# Altium schematic sheet fullCURRENT power motor drive.SchDoc: fullCURRENT 1.0
size C; Author: JNutzmann; CompanyName: FSE; DocumentNumber: 4
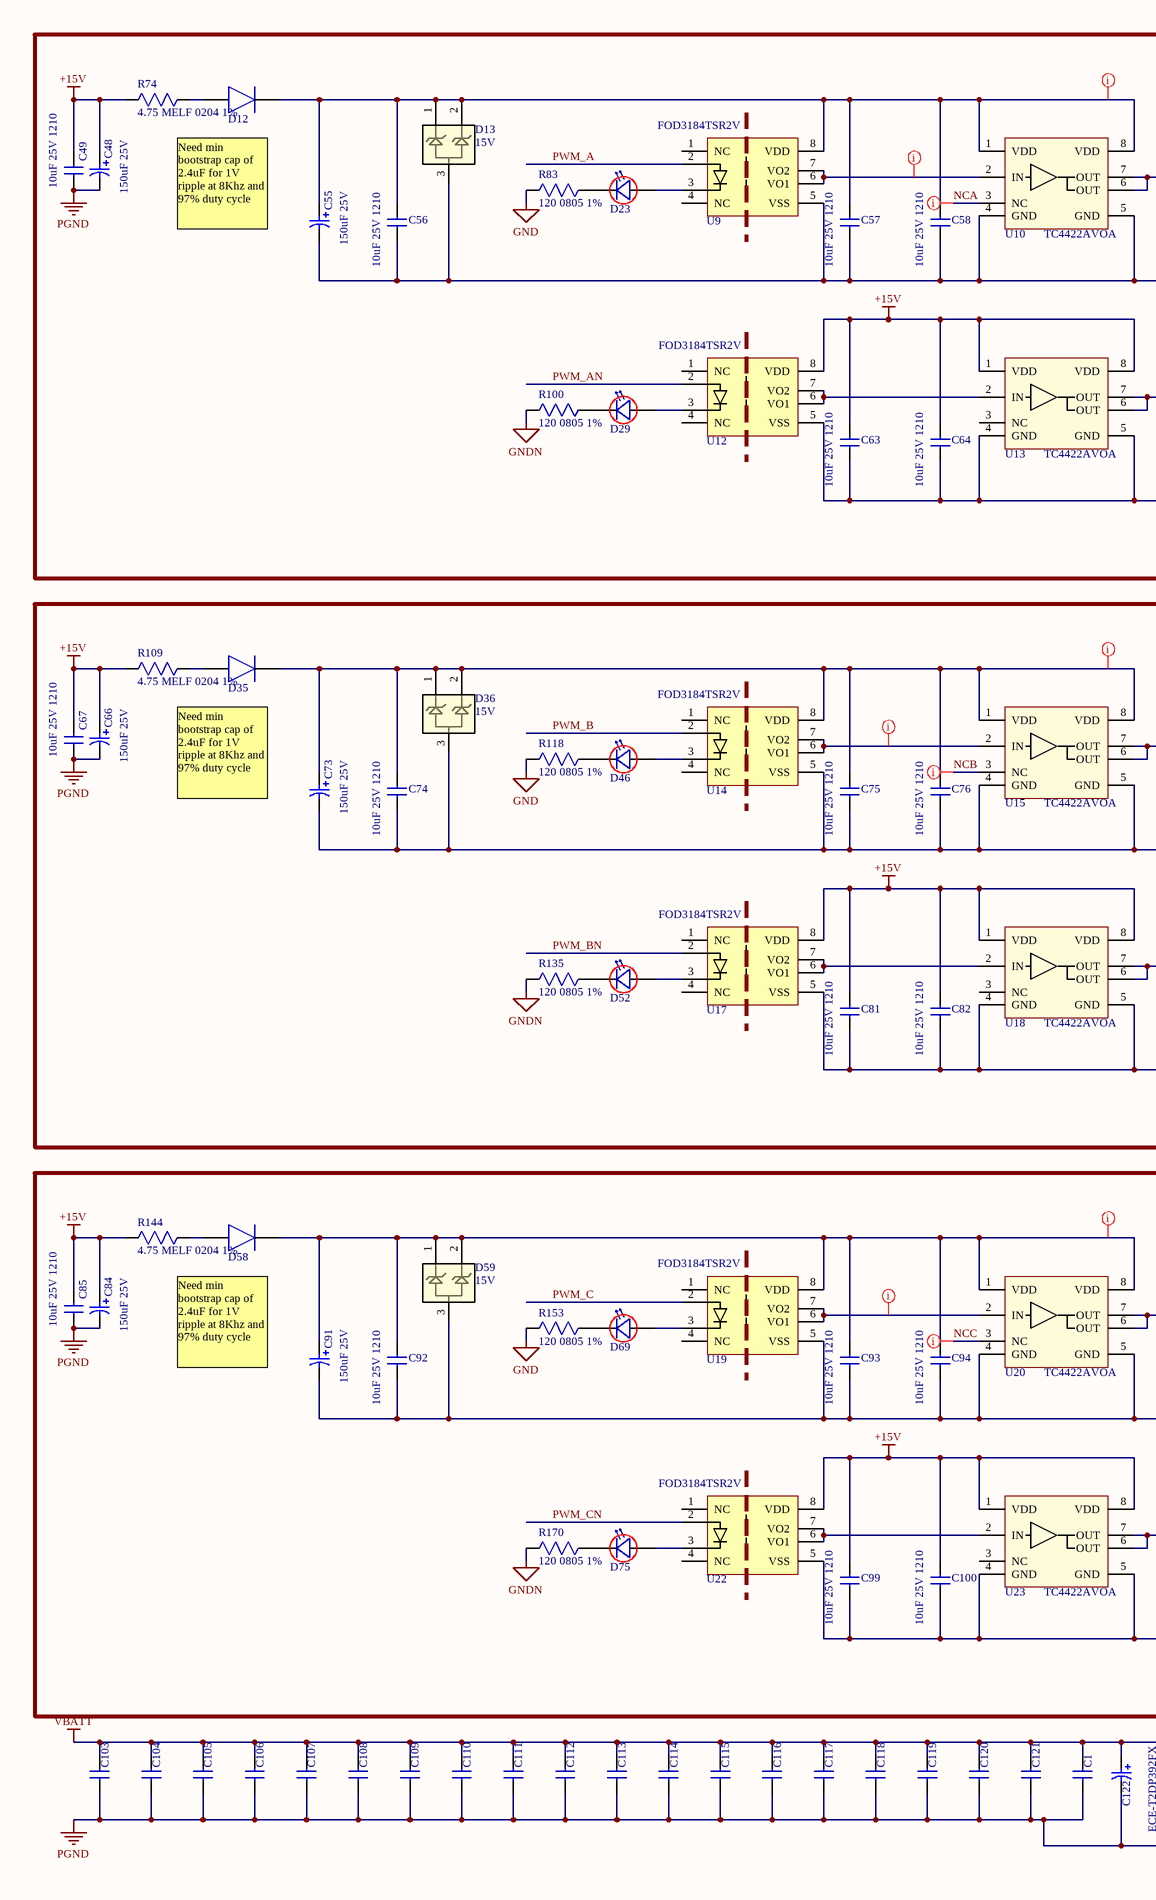
[diagram p0: fullCURRENT power motor drive.SchDoc, left]
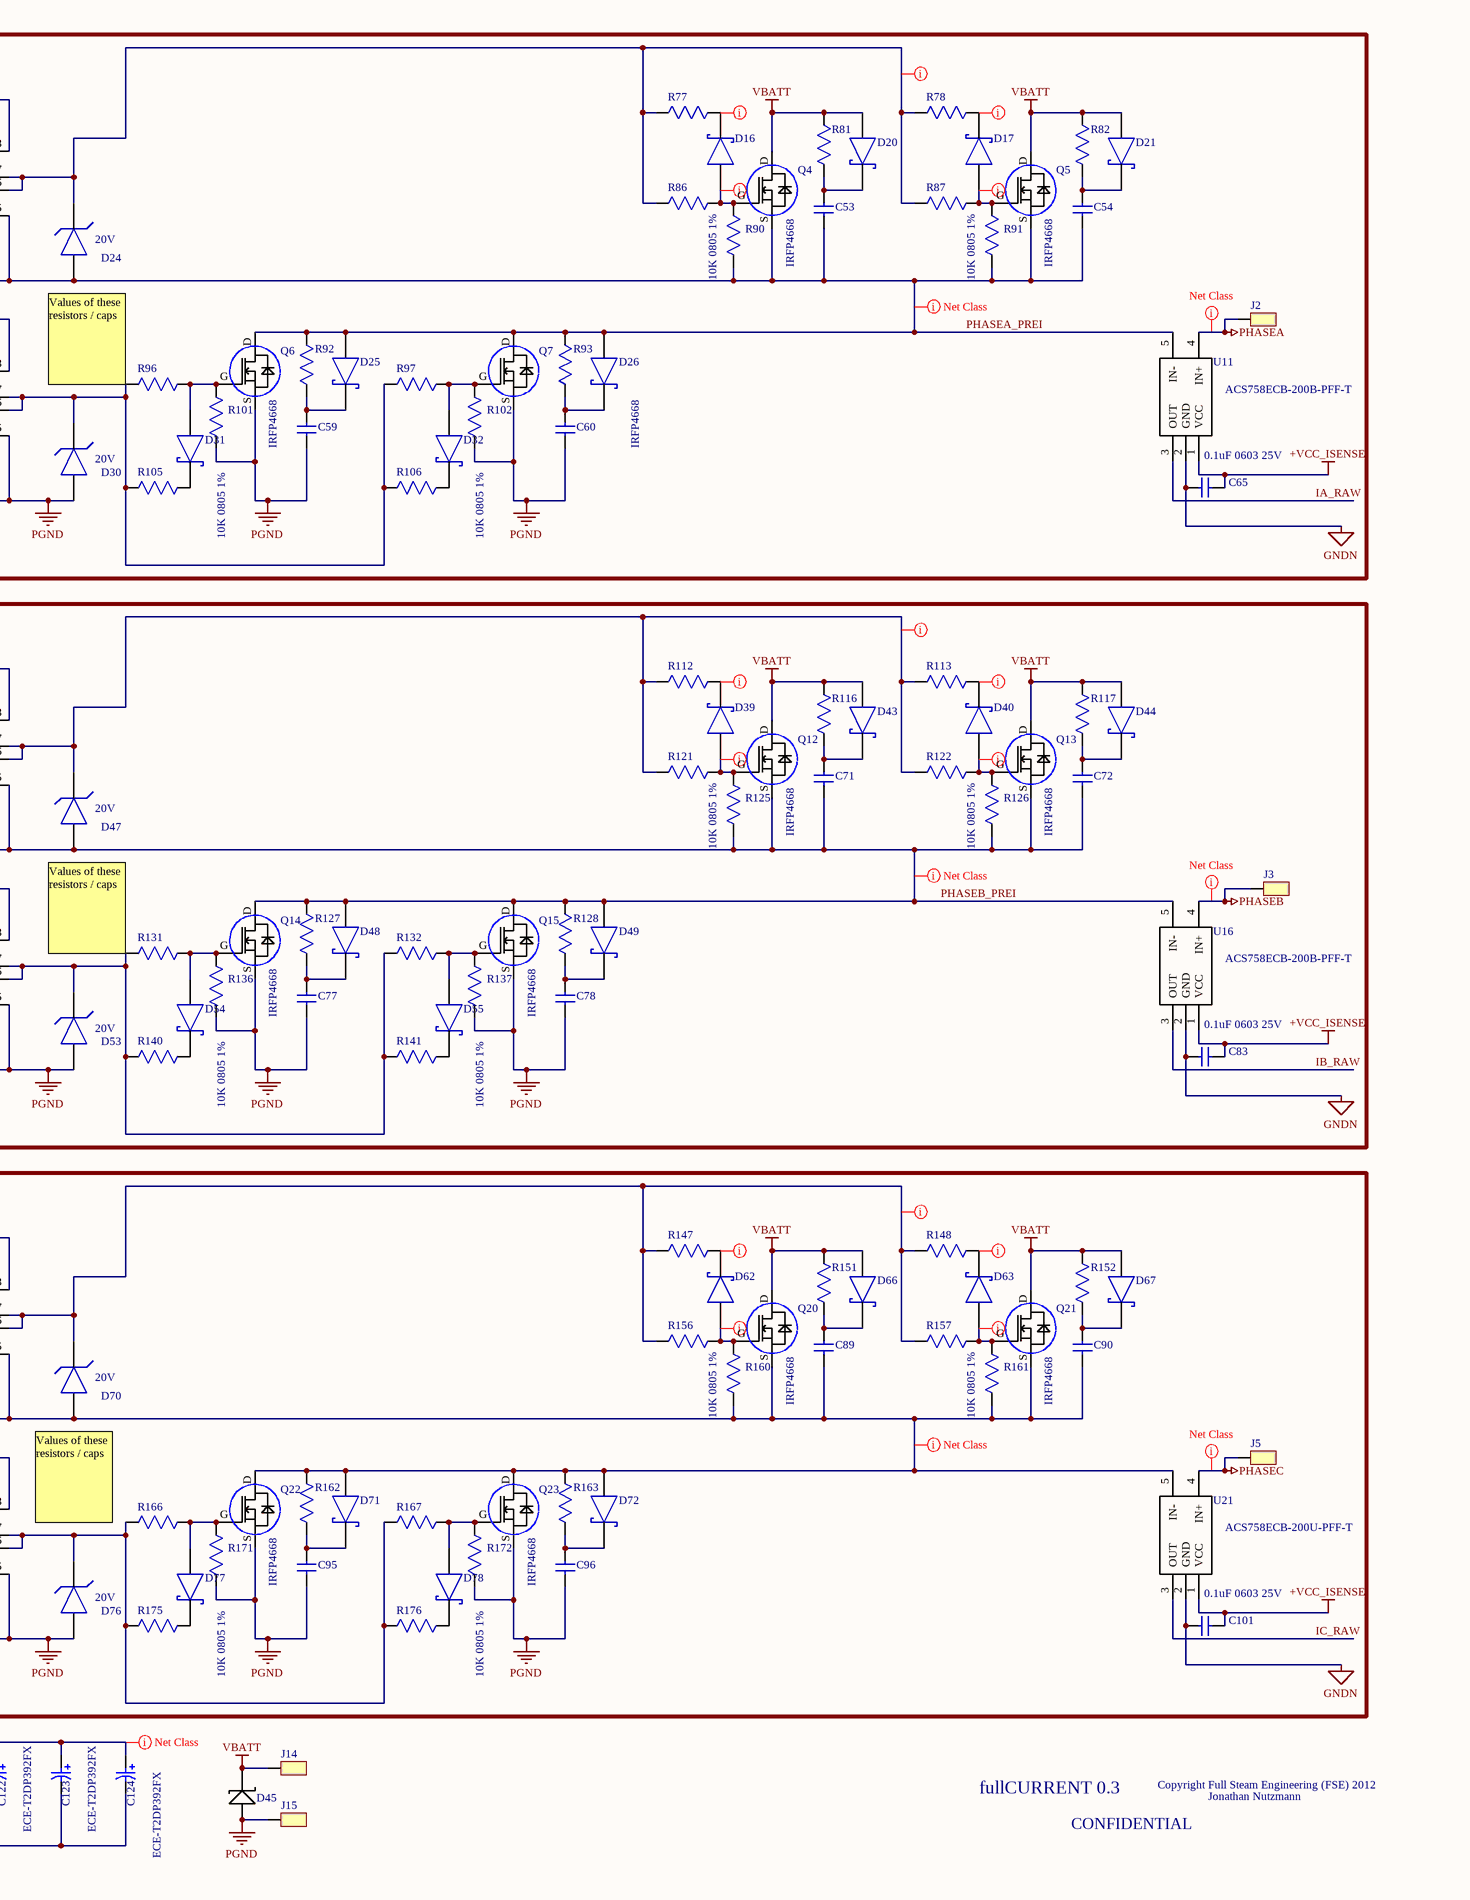
[diagram p1: fullCURRENT power motor drive.SchDoc, right]

## Parts
C1  CAP 1210  [1825_CAPACITOR]  (value not drawn)
C48  value 150uF 25V  [CAPPR2.5-6.3x11]  (hidden comment: C_UMA1E330MDD)
C49  value 10uF 25V 1210  [1210_Capacitor]  (hidden comment: CAP 1210)
C53  CAP 1210  [1210_Capacitor]  (value not drawn)
C54  CAP 1210  [1210_Capacitor]  (value not drawn)
C55  value 150uF 25V  [CAPPR2.5-6.3x11]  (hidden comment: C_UMA1E330MDD)
C56  value 10uF 25V 1210  [1210_Capacitor]  (hidden comment: CAP 1210)
C57  value 10uF 25V 1210  [1210_Capacitor]  (hidden comment: CAP 1210)
C58  value 10uF 25V 1210  [1210_Capacitor]  (hidden comment: CAP 1210)
C59  CAP 1210  [1210_Capacitor]  (value not drawn)
C60  CAP 1210  [1210_Capacitor]  (value not drawn)
C63  value 10uF 25V 1210  [1210_Capacitor]  (hidden comment: CAP 1210)
C64  value 10uF 25V 1210  [1210_Capacitor]  (hidden comment: CAP 1210)
C65  value 0.1uF 0603 25V  [0805_CAPACITOR]  (hidden comment: CAP 0603)
C66  value 150uF 25V  [CAPPR2.5-6.3x11]  (hidden comment: C_UMA1E330MDD)
C67  value 10uF 25V 1210  [1210_Capacitor]  (hidden comment: CAP 1210)
C71  CAP 1210  [1210_Capacitor]  (value not drawn)
C72  CAP 1210  [1210_Capacitor]  (value not drawn)
C73  value 150uF 25V  [CAPPR2.5-6.3x11]  (hidden comment: C_UMA1E330MDD)
C74  value 10uF 25V 1210  [1210_Capacitor]  (hidden comment: CAP 1210)
C75  value 10uF 25V 1210  [1210_Capacitor]  (hidden comment: CAP 1210)
C76  value 10uF 25V 1210  [1210_Capacitor]  (hidden comment: CAP 1210)
C77  CAP 1210  [1210_Capacitor]  (value not drawn)
C78  CAP 1210  [1210_Capacitor]  (value not drawn)
C81  value 10uF 25V 1210  [1210_Capacitor]  (hidden comment: CAP 1210)
C82  value 10uF 25V 1210  [1210_Capacitor]  (hidden comment: CAP 1210)
C83  value 0.1uF 0603 25V  [0805_CAPACITOR]  (hidden comment: CAP 0603)
C84  value 150uF 25V  [CAPPR2.5-6.3x11]  (hidden comment: C_UMA1E330MDD)
C85  value 10uF 25V 1210  [1210_Capacitor]  (hidden comment: CAP 1210)
C89  CAP 1210  [1210_Capacitor]  (value not drawn)
C90  CAP 1210  [1210_Capacitor]  (value not drawn)
C91  value 150uF 25V  [CAPPR2.5-6.3x11]  (hidden comment: C_UMA1E330MDD)
C92  value 10uF 25V 1210  [1210_Capacitor]  (hidden comment: CAP 1210)
C93  value 10uF 25V 1210  [1210_Capacitor]  (hidden comment: CAP 1210)
C94  value 10uF 25V 1210  [1210_Capacitor]  (hidden comment: CAP 1210)
C95  CAP 1210  [1210_Capacitor]  (value not drawn)
C96  CAP 1210  [1210_Capacitor]  (value not drawn)
C99  value 10uF 25V 1210  [1210_Capacitor]  (hidden comment: CAP 1210)
C100  value 10uF 25V 1210  [1210_Capacitor]  (hidden comment: CAP 1210)
C101  value 0.1uF 0603 25V  [0805_CAPACITOR]  (hidden comment: CAP 0603)
C103  CAP 1210  [1825_CAPACITOR]  (value not drawn)
C104  CAP 1210  [1825_CAPACITOR]  (value not drawn)
C105  CAP 1210  [1825_CAPACITOR]  (value not drawn)
C106  CAP 1210  [1825_CAPACITOR]  (value not drawn)
C107  CAP 1210  [1825_CAPACITOR]  (value not drawn)
C108  CAP 1210  [1825_CAPACITOR]  (value not drawn)
C109  CAP 1210  [1825_CAPACITOR]  (value not drawn)
C110  CAP 1210  [1825_CAPACITOR]  (value not drawn)
C111  CAP 1210  [1825_CAPACITOR]  (value not drawn)
C112  CAP 1210  [1825_CAPACITOR]  (value not drawn)
C113  CAP 1210  [1825_CAPACITOR]  (value not drawn)
C114  CAP 1210  [1825_CAPACITOR]  (value not drawn)
C115  CAP 1210  [1825_CAPACITOR]  (value not drawn)
C116  CAP 1210  [1825_CAPACITOR]  (value not drawn)
C117  CAP 1210  [1825_CAPACITOR]  (value not drawn)
C118  CAP 1210  [1825_CAPACITOR]  (value not drawn)
C119  CAP 1210  [1825_CAPACITOR]  (value not drawn)
C120  CAP 1210  [1825_CAPACITOR]  (value not drawn)
C121  CAP 1210  [1825_CAPACITOR]  (value not drawn)
C122  Part Number: ECE-T2DP392FX  [T-UP Series 4 Pin]  (hidden comment: C_ECE-T2DP392FX)
C123  Part Number: ECE-T2DP392FX  [T-UP Series 4 Pin]  (hidden comment: C_ECE-T2DP392FX)
C124  Part Number: ECE-T2DP392FX  [T-UP Series 4 Pin]  (hidden comment: C_ECE-T2DP392FX)
D12  D_ES1D  [SMA]  (value not drawn)
D13  15V  [SOT-23]
D16  D_PMEG4050EP,115  [SOD128]  (value not drawn)
D17  D_PMEG4050EP,115  [SOD128]  (value not drawn)
D20  D_MBRS3200T3G  [SMB]  (value not drawn)
D21  D_MBRS3200T3G  [SMB]  (value not drawn)
D23  D_LED_0805_RED  [0805P_RED]  (value not drawn)
D24  Standoff Voltage: 20V  [SMA]  (hidden comment: DIODE TVS 20V 400W UNI 5% SMD)
D25  D_MBRS3200T3G  [SMB]  (value not drawn)
D26  D_MBRS3200T3G  [SMB]  (value not drawn)
D29  D_LED_0805_RED  [0805P_RED]  (value not drawn)
D30  Standoff Voltage: 20V  [SMA]  (hidden comment: DIODE TVS 20V 400W UNI 5% SMD)
D31  D_PMEG4050EP,115  [SOD128]  (value not drawn)
D32  D_PMEG4050EP,115  [SOD128]  (value not drawn)
D35  D_ES1D  [SMA]  (value not drawn)
D36  15V  [SOT-23]
D39  D_PMEG4050EP,115  [SOD128]  (value not drawn)
D40  D_PMEG4050EP,115  [SOD128]  (value not drawn)
D43  D_MBRS3200T3G  [SMB]  (value not drawn)
D44  D_MBRS3200T3G  [SMB]  (value not drawn)
D45  D_5KP180A  [DIODE_TVS_5000W]  (value not drawn)
D46  D_LED_0805_RED  [0805P_RED]  (value not drawn)
D47  Standoff Voltage: 20V  [SMA]  (hidden comment: DIODE TVS 20V 400W UNI 5% SMD)
D48  D_MBRS3200T3G  [SMB]  (value not drawn)
D49  D_MBRS3200T3G  [SMB]  (value not drawn)
D52  D_LED_0805_RED  [0805P_RED]  (value not drawn)
D53  Standoff Voltage: 20V  [SMA]  (hidden comment: DIODE TVS 20V 400W UNI 5% SMD)
D54  D_PMEG4050EP,115  [SOD128]  (value not drawn)
D55  D_PMEG4050EP,115  [SOD128]  (value not drawn)
D58  D_ES1D  [SMA]  (value not drawn)
D59  15V  [SOT-23]
D62  D_PMEG4050EP,115  [SOD128]  (value not drawn)
D63  D_PMEG4050EP,115  [SOD128]  (value not drawn)
D66  D_MBRS3200T3G  [SMB]  (value not drawn)
D67  D_MBRS3200T3G  [SMB]  (value not drawn)
D69  D_LED_0805_RED  [0805P_RED]  (value not drawn)
D70  Standoff Voltage: 20V  [SMA]  (hidden comment: DIODE TVS 20V 400W UNI 5% SMD)
D71  D_MBRS3200T3G  [SMB]  (value not drawn)
D72  D_MBRS3200T3G  [SMB]  (value not drawn)
D75  D_LED_0805_RED  [0805P_RED]  (value not drawn)
D76  Standoff Voltage: 20V  [SMA]  (hidden comment: DIODE TVS 20V 400W UNI 5% SMD)
D77  D_PMEG4050EP,115  [SOD128]  (value not drawn)
D78  D_PMEG4050EP,115  [SOD128]  (value not drawn)
J2  J_POWER ELEMENT 90DEG M8 10PIN  [POWER ELEMENT 90DEG M8 10PIN]  (value not drawn)
J3  J_POWER ELEMENT 90DEG M8 10PIN  [POWER ELEMENT 90DEG M8 10PIN]  (value not drawn)
J5  J_POWER ELEMENT 90DEG M8 10PIN  [POWER ELEMENT 90DEG M8 10PIN]  (value not drawn)
J14  J_POWER ELEMENT 90DEG M8 10PIN  [POWER ELEMENT 90DEG M8 10PIN]  (value not drawn)
J15  J_POWER ELEMENT 90DEG M8 10PIN  [POWER ELEMENT 90DEG M8 10PIN]  (value not drawn)
Q4  IRFP4668  [TO-247-UNDER]
Q5  IRFP4668  [TO-247-UNDER]
Q6  IRFP4668  [TO-247-UNDER]
Q7  IRFP4668  [TO-247-UNDER]
Q12  IRFP4668  [TO-247-UNDER]
Q13  IRFP4668  [TO-247-UNDER]
Q14  IRFP4668  [TO-247-UNDER]
Q15  IRFP4668  [TO-247-UNDER]
Q20  IRFP4668  [TO-247-UNDER]
Q21  IRFP4668  [TO-247-UNDER]
Q22  IRFP4668  [TO-247-UNDER]
Q23  IRFP4668  [TO-247-UNDER]
R74  value 4.75 MELF 0204 1%  [MELF 0204]  (hidden comment: RES MELF 0204)
R77  RES MELF 0204  [MELF 0204]  (value not drawn)
R78  RES MELF 0204  [MELF 0204]  (value not drawn)
R81  RES MELF 0204  [MELF 0204]  (value not drawn)
R82  RES MELF 0204  [MELF 0204]  (value not drawn)
R83  value 120 0805 1%  [0603_res]  (hidden comment: RES 0603)
R86  RES MELF 0204  [MELF 0204]  (value not drawn)
R87  RES MELF 0204  [MELF 0204]  (value not drawn)
R90  value 10K 0805 1%  [0805_RESISTOR]  (hidden comment: RES 0805)
R91  value 10K 0805 1%  [0805_RESISTOR]  (hidden comment: RES 0805)
R92  RES MELF 0204  [MELF 0204]  (value not drawn)
R93  RES MELF 0204  [MELF 0204]  (value not drawn)
R96  RES MELF 0204  [MELF 0204]  (value not drawn)
R97  RES MELF 0204  [MELF 0204]  (value not drawn)
R100  value 120 0805 1%  [0603_res]  (hidden comment: RES 0603)
R101  value 10K 0805 1%  [0805_RESISTOR]  (hidden comment: RES 0805)
R102  value 10K 0805 1%  [0805_RESISTOR]  (hidden comment: RES 0805)
R105  RES MELF 0204  [MELF 0204]  (value not drawn)
R106  RES MELF 0204  [MELF 0204]  (value not drawn)
R109  value 4.75 MELF 0204 1%  [MELF 0204]  (hidden comment: RES MELF 0204)
R112  RES MELF 0204  [MELF 0204]  (value not drawn)
R113  RES MELF 0204  [MELF 0204]  (value not drawn)
R116  RES MELF 0204  [MELF 0204]  (value not drawn)
R117  RES MELF 0204  [MELF 0204]  (value not drawn)
R118  value 120 0805 1%  [0603_res]  (hidden comment: RES 0603)
R121  RES MELF 0204  [MELF 0204]  (value not drawn)
R122  RES MELF 0204  [MELF 0204]  (value not drawn)
R125  value 10K 0805 1%  [0805_RESISTOR]  (hidden comment: RES 0805)
R126  value 10K 0805 1%  [0805_RESISTOR]  (hidden comment: RES 0805)
R127  RES MELF 0204  [MELF 0204]  (value not drawn)
R128  RES MELF 0204  [MELF 0204]  (value not drawn)
R131  RES MELF 0204  [MELF 0204]  (value not drawn)
R132  RES MELF 0204  [MELF 0204]  (value not drawn)
R135  value 120 0805 1%  [0603_res]  (hidden comment: RES 0603)
R136  value 10K 0805 1%  [0805_RESISTOR]  (hidden comment: RES 0805)
R137  value 10K 0805 1%  [0805_RESISTOR]  (hidden comment: RES 0805)
R140  RES MELF 0204  [MELF 0204]  (value not drawn)
R141  RES MELF 0204  [MELF 0204]  (value not drawn)
R144  value 4.75 MELF 0204 1%  [MELF 0204]  (hidden comment: RES MELF 0204)
R147  RES MELF 0204  [MELF 0204]  (value not drawn)
R148  RES MELF 0204  [MELF 0204]  (value not drawn)
R151  RES MELF 0204  [MELF 0204]  (value not drawn)
R152  RES MELF 0204  [MELF 0204]  (value not drawn)
R153  value 120 0805 1%  [0603_res]  (hidden comment: RES 0603)
R156  RES MELF 0204  [MELF 0204]  (value not drawn)
R157  RES MELF 0204  [MELF 0204]  (value not drawn)
R160  value 10K 0805 1%  [0805_RESISTOR]  (hidden comment: RES 0805)
R161  value 10K 0805 1%  [0805_RESISTOR]  (hidden comment: RES 0805)
R162  RES MELF 0204  [MELF 0204]  (value not drawn)
R163  RES MELF 0204  [MELF 0204]  (value not drawn)
R166  RES MELF 0204  [MELF 0204]  (value not drawn)
R167  RES MELF 0204  [MELF 0204]  (value not drawn)
R170  value 120 0805 1%  [0603_res]  (hidden comment: RES 0603)
R171  value 10K 0805 1%  [0805_RESISTOR]  (hidden comment: RES 0805)
R172  value 10K 0805 1%  [0805_RESISTOR]  (hidden comment: RES 0805)
R175  RES MELF 0204  [MELF 0204]  (value not drawn)
R176  RES MELF 0204  [MELF 0204]  (value not drawn)
U9  Part Number: FOD3184TSR2V  [8-SMD]  (hidden comment: U_FOD3184TSR2V)
U10  TC4422AVOA  [SOIC127P600X175-8N]
U11  Part Number: ACS758ECB-200B-PFF-T  [ACS758]  (hidden comment: U_ACS758x-CB-PFF)
U12  Part Number: FOD3184TSR2V  [8-SMD]  (hidden comment: U_FOD3184TSR2V)
U13  TC4422AVOA  [SOIC127P600X175-8N]
U14  Part Number: FOD3184TSR2V  [8-SMD]  (hidden comment: U_FOD3184TSR2V)
U15  TC4422AVOA  [SOIC127P600X175-8N]
U16  Part Number: ACS758ECB-200B-PFF-T  [ACS758]  (hidden comment: U_ACS758x-CB-PFF)
U17  Part Number: FOD3184TSR2V  [8-SMD]  (hidden comment: U_FOD3184TSR2V)
U18  TC4422AVOA  [SOIC127P600X175-8N]
U19  Part Number: FOD3184TSR2V  [8-SMD]  (hidden comment: U_FOD3184TSR2V)
U20  TC4422AVOA  [SOIC127P600X175-8N]
U21  Part Number: ACS758ECB-200U-PFF-T  [ACS758]  (hidden comment: U_ACS758x-CB-PFF)
U22  Part Number: FOD3184TSR2V  [8-SMD]  (hidden comment: U_FOD3184TSR2V)
U23  TC4422AVOA  [SOIC127P600X175-8N]

## Nets
+15V: C48.1 C49.1 C63.1 C64.1 C66.1 C67.1 C81.1 C82.1 C84.1 C85.1 C99.1 C100.1 R74.2 R109.2 R144.2 U12.8(VDD) U13.1(VDD) U13.8(VDD) U17.8(VDD) U18.1(VDD) U18.8(VDD) U22.8(VDD) U23.1(VDD) U23.8(VDD)
+VCC_ISENSE: C65.1 C83.1 C101.1 U11.1(VCC) U16.1(VCC) U21.1(VCC)
GND: R83.2 R118.2 R153.2
GNDN: C65.2 C83.2 C101.2 R100.2 R135.2 R170.2 U11.2(GND) U16.2(GND) U21.2(GND)
PGND: C1.2 C48.2 C49.2 C59.2 C60.2 C63.2 C64.2 C66.2 C67.2 C77.2 C78.2 C81.2 C82.2 C84.2 C85.2 C95.2 C96.2 C99.2 C100.2 C103.2 C104.2 C105.2 C106.2 C107.2 C108.2 C109.2 C110.2 C111.2 C112.2 C113.2 C114.2 C115.2 C116.2 C117.2 C118.2 C119.2 C120.2 C121.2 C122.2 C123.2 C124.2 D30.A D45.A(Anode) D53.A D76.A J15.0 Q6.S(Source) Q7.S(Source) Q14.S(Source) Q15.S(Source) Q22.S(Source) Q23.S(Source) R101.2 R102.2 R136.2 R137.2 R171.2 R172.2 U12.5(VSS) U13.4(GND) U13.5(GND) U17.5(VSS) U18.4(GND) U18.5(GND) U22.5(VSS) U23.4(GND) U23.5(GND)
PHASEA: J2.0 U11.4(IN+)
PHASEB: J3.0 U16.4(IN+)
PHASEC: J5.0 U21.4(IN+)
VBATT: C1.1 C103.1 C104.1 C105.1 C106.1 C107.1 C108.1 C109.1 C110.1 C111.1 C112.1 C113.1 C114.1 C115.1 C116.1 C117.1 C118.1 C119.1 C120.1 C121.1 C122.1 C123.1 C124.1 D20.A D21.A D43.A D44.A D45.K(Cathode) D66.A D67.A J14.0 Q4.D(Drain) Q5.D(Drain) Q12.D(Drain) Q13.D(Drain) Q20.D(Drain) Q21.D(Drain) R81.1 R82.1 R116.1 R117.1 R151.1 R152.1
IA_RAW: U11.3(OUT)
IB_RAW: U16.3(OUT)
IC_RAW: U21.3(OUT)
NCA: U10.3(NC)
NCB: U15.3(NC)
NCC: U20.3(NC)
PHASEA_PREI: C53.2 C54.2 C55.2 C56.2 C57.2 C58.2 D13.3 D24.A D25.A D26.A Q4.S(Source) Q5.S(Source) Q6.D(Drain) Q7.D(Drain) R90.2 R91.2 R92.1 R93.1 U9.5(VSS) U10.4(GND) U10.5(GND) U11.5(IN-)
PHASEB_PREI: C71.2 C72.2 C73.2 C74.2 C75.2 C76.2 D36.3 D47.A D48.A D49.A Q12.S(Source) Q13.S(Source) Q14.D(Drain) Q15.D(Drain) R125.2 R126.2 R127.1 R128.1 U14.5(VSS) U15.4(GND) U15.5(GND) U16.5(IN-)
PWM_A: U9.2
PWM_AN: U12.2
PWM_B: U14.2
PWM_BN: U17.2
PWM_C: U19.2
PWM_CN: U22.2
NetC53_1: C53.1 D20.K R81.2
NetC54_1: C54.1 D21.K R82.2
NetC55_1: C55.1 C56.1 C57.1 C58.1 D12.K D13.1 D13.2 U9.8(VDD) U10.1(VDD) U10.8(VDD)
NetC59_1: C59.1 D25.K R92.2
NetC60_1: C60.1 D26.K R93.2
NetC71_1: C71.1 D43.K R116.2
NetC72_1: C72.1 D44.K R117.2
NetC73_1: C73.1 C74.1 C75.1 C76.1 D35.K D36.1 D36.2 U14.8(VDD) U15.1(VDD) U15.8(VDD)
NetC77_1: C77.1 D48.K R127.2
NetC78_1: C78.1 D49.K R128.2
NetC89_1: C89.1 D66.K R151.2
NetC89_2: C89.2 C90.2 C91.2 C92.2 C93.2 C94.2 D59.3 D70.A D71.A D72.A Q20.S(Source) Q21.S(Source) Q22.D(Drain) Q23.D(Drain) R160.2 R161.2 R162.1 R163.1 U19.5(VSS) U20.4(GND) U20.5(GND) U21.5(IN-)
NetC90_1: C90.1 D67.K R152.2
NetC91_1: C91.1 C92.1 C93.1 C94.1 D58.K D59.1 D59.2 U19.8(VDD) U20.1(VDD) U20.8(VDD)
NetC95_1: C95.1 D71.K R162.2
NetC96_1: C96.1 D72.K R163.2
NetD12_A: D12.A R74.1
NetD16_A: D16.A Q4.G(Gate) R86.1 R90.1
NetD16_K: D16.K R77.1
NetD17_A: D17.A Q5.G(Gate) R87.1 R91.1
NetD17_K: D17.K R78.1
NetD23_1: D23.1(Cathode) R83.1
NetD23_2: D23.2(Anode) U9.3
NetD24_K: D24.K R77.2 R78.2 R86.2 R87.2 U10.6(OUT) U10.7(OUT)
NetD29_1: D29.1(Cathode) R100.1
NetD29_2: D29.2(Anode) U12.3
NetD30_K: D30.K R96.2 R97.2 R105.2 R106.2 U13.6(OUT) U13.7(OUT)
NetD31_A: D31.A Q6.G(Gate) R96.1 R101.1
NetD31_K: D31.K R105.1
NetD32_A: D32.A Q7.G(Gate) R97.1 R102.1
NetD32_K: D32.K R106.1
NetD35_A: D35.A R109.1
NetD39_A: D39.A Q12.G(Gate) R121.1 R125.1
NetD39_K: D39.K R112.1
NetD40_A: D40.A Q13.G(Gate) R122.1 R126.1
NetD40_K: D40.K R113.1
NetD46_1: D46.1(Cathode) R118.1
NetD46_2: D46.2(Anode) U14.3
NetD47_K: D47.K R112.2 R113.2 R121.2 R122.2 U15.6(OUT) U15.7(OUT)
NetD52_1: D52.1(Cathode) R135.1
NetD52_2: D52.2(Anode) U17.3
NetD53_K: D53.K R131.2 R132.2 R140.2 R141.2 U18.6(OUT) U18.7(OUT)
NetD54_A: D54.A Q14.G(Gate) R131.1 R136.1
NetD54_K: D54.K R140.1
NetD55_A: D55.A Q15.G(Gate) R132.1 R137.1
NetD55_K: D55.K R141.1
NetD58_A: D58.A R144.1
NetD62_A: D62.A Q20.G(Gate) R156.1 R160.1
NetD62_K: D62.K R147.1
NetD63_A: D63.A Q21.G(Gate) R157.1 R161.1
NetD63_K: D63.K R148.1
NetD69_1: D69.1(Cathode) R153.1
NetD69_2: D69.2(Anode) U19.3
NetD70_K: D70.K R147.2 R148.2 R156.2 R157.2 U20.6(OUT) U20.7(OUT)
NetD75_1: D75.1(Cathode) R170.1
NetD75_2: D75.2(Anode) U22.3
NetD76_K: D76.K R166.2 R167.2 R175.2 R176.2 U23.6(OUT) U23.7(OUT)
NetD77_A: D77.A Q22.G(Gate) R166.1 R171.1
NetD77_K: D77.K R175.1
NetD78_A: D78.A Q23.G(Gate) R167.1 R172.1
NetD78_K: D78.K R176.1
NetU9_6: U9.6(VO1) U9.7(VO2) U10.2(IN)
NetU12_6: U12.6(VO1) U12.7(VO2) U13.2(IN)
NetU14_6: U14.6(VO1) U14.7(VO2) U15.2(IN)
NetU17_6: U17.6(VO1) U17.7(VO2) U18.2(IN)
NetU19_6: U19.6(VO1) U19.7(VO2) U20.2(IN)
NetU22_6: U22.6(VO1) U22.7(VO2) U23.2(IN)

Not connected (* = marked no-connect by the designer): U9 1(NC) 4(NC); U12 1(NC) 4(NC); U13 3(NC); U14 1(NC) 4(NC); U17 1(NC) 4(NC); U18 3(NC); U19 1(NC) 4(NC); U22 1(NC) 4(NC); U23 3(NC)

## Layout directives
net class HV: NetC89_2, PHASEA, PHASEA_PREI, PHASEB, PHASEB_PREI, PHASEC, VBATT
net class A_HS_GATE: NCA, NetC55_1, NetD16_A, NetD16_K, NetD17_A, NetD17_K, NetD24_K, NetU9_6
net class B_HS_GATE: NCB, NetC73_1, NetD39_A, NetD39_K, NetD40_A, NetD40_K, NetD47_K, NetU14_6
net class C_HS_GATE: NCC, NetC91_1, NetD62_A, NetD62_K, NetD63_A, NetD63_K, NetD70_K, NetU19_6

## Notes on the sheet
- Need min bootstrap cap of 2.4uF for 1V ripple at 8Khz and 97% duty cycle
- (near R96) Values of these resistors / caps
- (near R131) Values of these resistors / caps
- Values of these resistors / caps
- fullCURRENT 0.3
- Copyright Full Steam Engineering (FSE) 2012
- Jonathan Nutzmann
- CONFIDENTIAL

## Library data of the parts
C1 C103-C121 = C_1210: CAP CER 1UF 250V 10% X7R 1825; Supplier 1: Digi-Key; Supplier Part Number 1: 709-1048-1-ND
C48 C55 C66 C73 C84 C91 = C_UMA1E330MDD: CAP ALUM 150UF 25V 20% RADIAL; Supplier 1: Digi-Key; Supplier Part Number 1: P14414-ND
C49 C56-C58 C63 C64 C67 C74-C76 C81 C82 C85 C92-C94 C99 C100 = C_1210: CAP CER 10UF 25V 10% X7R 1210; Supplier 1: Digi-Key; Supplier Part Number 1: 587-2599-1-ND
C53 C54 C59 C60 C71 C72 C77 C78 C89 C90 C95 C96 = C_1210: CAP CERM 1210; Known Distributors: Digikey; Package: 1210
C65 C83 C101 = C_0603: CAP CERM 0.1uF 0603 X7R; Supplier 1: Digi-Key; Supplier Part Number 1: 490-1524-1-ND
C122-C124 = C_ECE-T2DP392FX: CAP ALUM 3900UF 200V 20% SNAP; Manufacturer: Panasonic; Supplier 1: Digi-Key; Supplier Part Number 1: P13178-ND
D12 D35 D58 = D_ES1D: DIODE ULTRAFAST 200V 1A DO-214AC; Supplier 1: Digi-Key; Supplier Part Number 1: ES1DFSCT-ND
D13 D36 D59 = SM15: 15V TVS SOT23; Supplier 1: Digi-Key; Supplier Part Number 1: GSOT15C-GS08CT-ND
D16 D17 D31 D32 D39 D40 D54 D55 D62 D63 D77 D78 = D_PMEG4050EP,115: SCHOTTKY RECT 40V 5A SOD128; Manufacturer: NXP; Package: SOD128; Part Number: PMEG4050EP,115; Supplier 1: Digi-Key; Supplier Part Number 1: 568-7408-1-ND
D20 D21 D25 D26 D43 D44 D48 D49 D66 D67 D71 D72 = D_MBRS3200T3G: DIODE SCHOTTKY 3A 200V SMB; Manufacturer: ON Semiconductor; Package: SMB; Manufacturer PN: MBRS3200T3G; Supplier 1: Digi-Key; Supplier Part Number 1: MBRS3200T3GOSCT-ND
D23 D29 D46 D52 D69 D75 = D_LED_0805_RED: LED RED 0805; Supplier 1: Digi-Key; Supplier Part Number 1: 475-1415-1-ND
D24 D30 D47 D53 D70 D76 = D_SMAJ20A: Manufactuer: Bournes Inc; Breakdown Voltage: 22.2V; Part Number: SMAJ20A; Supplier 1: Digi-Key; Supplier Part Number 1: SMAJ20ABCT-ND
D45 = D_5KP180A: 5KP180A; Supplier 1: Digi-Key; Supplier Part Number 1: 497-6628-1-ND
J2 J3 J5 J14 J15 = J_POWER ELEMENT 90DEG M8 10PIN: Part Number: 7461108; Manufacturer: Wurth; Supplier 1: Digi-Key; Supplier Part Number 1: 732-3230-ND
R74 R77 R78 R81 R82 R86 R87 R92 R93 R96 R97 R105 R106 R109 R112 R113 R116 R117 R121 R122 R127 R128 R131 R132 R140 R141 R144 R147 R148 R151 R152 R156 R157 R162 R163 R166 R167 R175 R176 = R_MELF_0204
  R74 R109 R144: Supplier 1: Digi-Key; Supplier Part Number 1: 311-4.75BUCT-ND
  R77 R78 R86 R87 R96 R97 R105 R106 R112 R113 R121 R122 R131 R132 R140 R141 R147 R148 R156 R157 R166 R167 R175 R176: Package: MELF 0204; Supplier 1: Digi-Key; Supplier Part Number 1: MMA-6.80ACT-ND
  R81 R82 R92 R93 R116 R117 R127 R128 R151 R152 R162 R163: Known Distributors: Digikey; Package: MELF 0204
R83 R90 R91 R100-R102 R118 R125 R126 R135-R137 R153 R160 R161 R170-R172 = R_0603
  R83 R100 R118 R135 R153 R170: Supplier 1: Digi-Key; Supplier Part Number 1: 311-120HRCT-ND
U9 U12 U14 U17 U19 U22 = U_FOD3184TSR2V: OPTO MOSFET/IGBT GATE DVR 8-SMD; Manufacturer: Fairchild; Supplier 1: Digi-Key; Supplier Part Number 1: FOD3184TSR2VCT-ND
U10 U13 U15 U18 U20 U23 = U_TC4422AVOA: IC MOSFET DVR 9A NON-INV 8SOIC; Manufacturer: Microchip; Part Number: TC4422AVOA; Supplier 1: Digi-Key; Supplier Part Number 1: TC4422AVOA-ND
U11 U16 U21 = U_ACS758x-CB-PFF: IC SENSOR CURRENT 200A UNI 3-CB; Manufacturer: Allegro; Supplier 1: Digi-Key; Supplier Part Number 1: 620-1356-ND
Q4-Q7 Q12-Q15 Q20-Q23 = IRFP4668: Supplier 1: Digi-Key; Supplier Part Number 1: IRFP4668PBF-ND